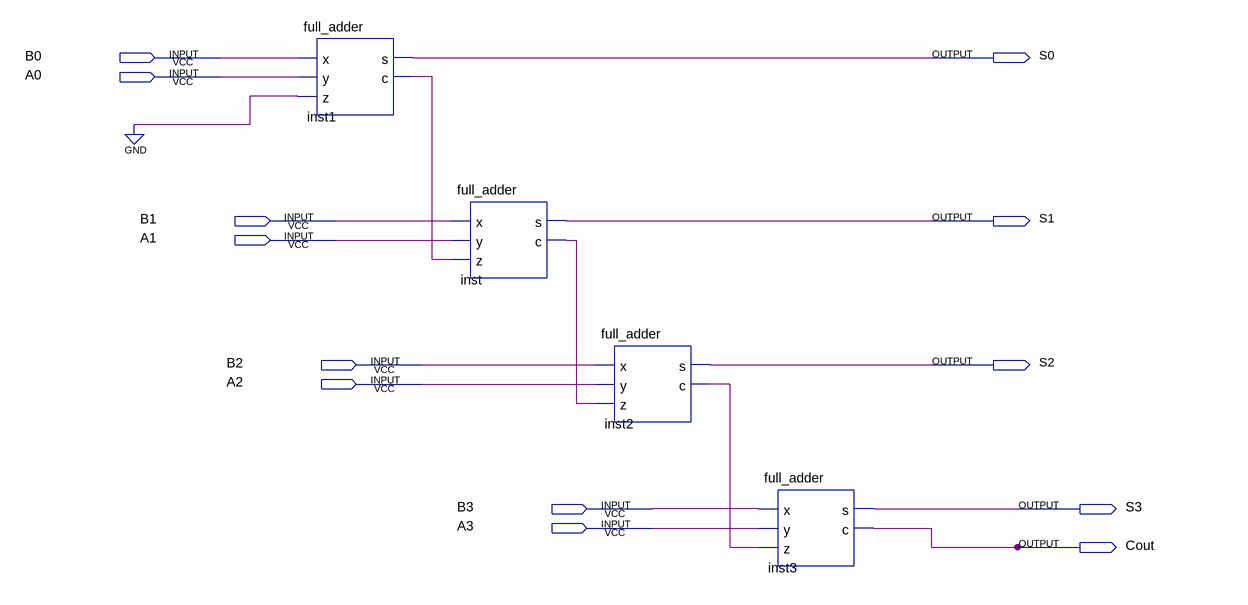
[diagram p0: schematic sheet]
// Quartus schematic four_bit_adder.bdf as structural Verilog: 4 symbols, 13 pins
module four_bit_adder (
  input  B0,
  input  A0,
  input  B1,
  input  A1,
  input  B2,
  input  A2,
  input  B3,
  input  A3,
  output S0,
  output S1,
  output S2,
  output S3,
  output Cout
);

  wire inst1_c, inst2_c, inst_c;

  full_adder inst1 (.x(B0), .y(A0), .z(1'b0), .s(S0), .c(inst1_c));
  full_adder inst (.x(B1), .y(A1), .z(inst1_c), .s(S1), .c(inst_c));
  full_adder inst2 (.x(B2), .y(A2), .z(inst_c), .s(S2), .c(inst2_c));
  full_adder inst3 (.x(B3), .y(A3), .z(inst2_c), .s(S3), .c(Cout));
endmodule
